# EAGLE schematic enut30d (EAGLE 4.11)

## Sheet 1 of 4
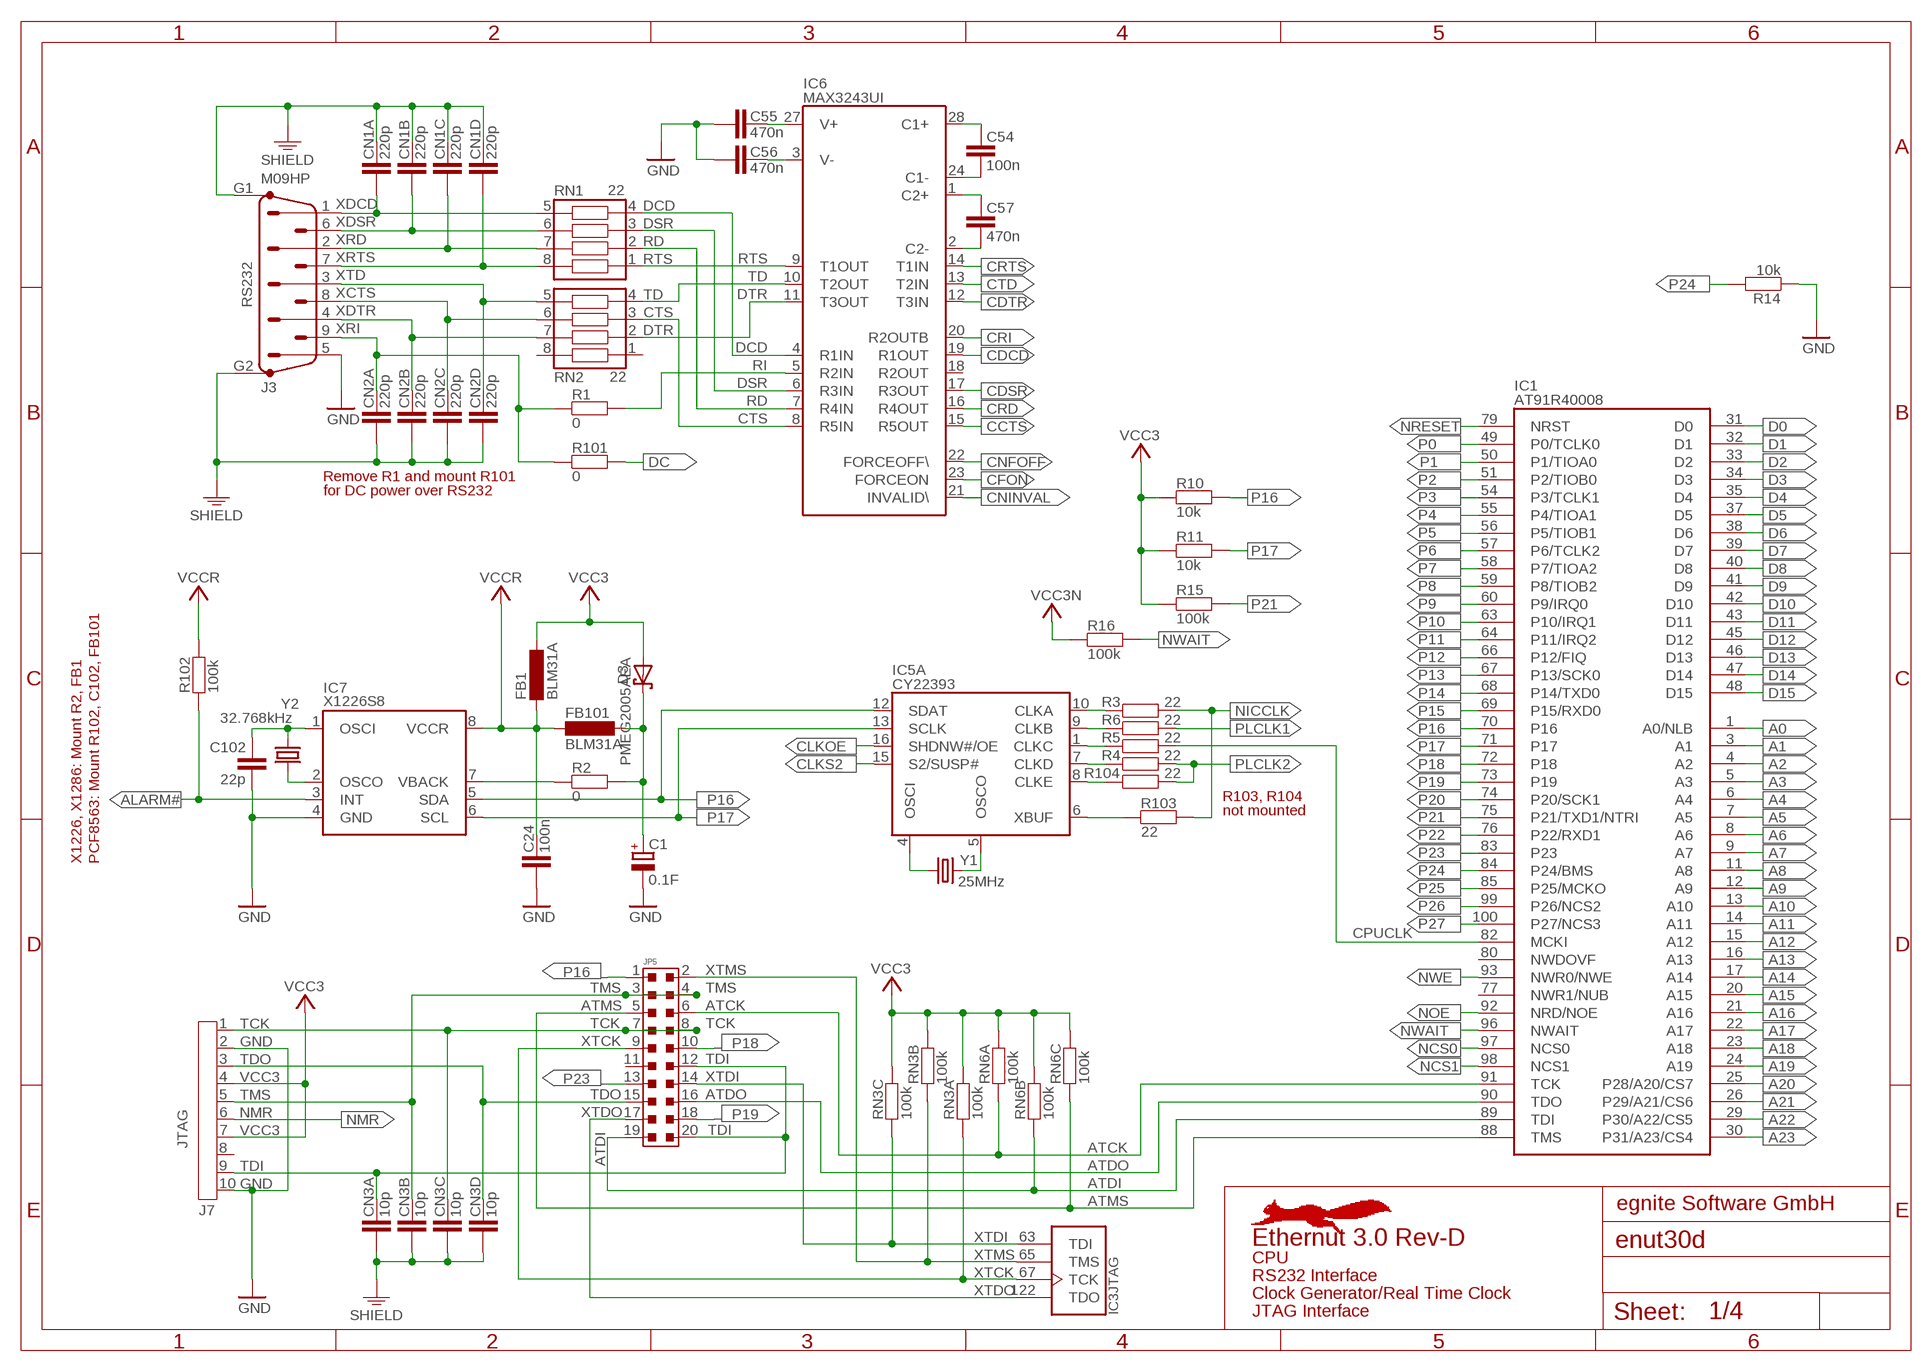
[diagram p0: schematic, sheet 1]

### Parts
C1  0.1F  FG0H104Z135  [CDL13_5]
C24  100n  C0603  [C0603]
C54  100n  C0603  [C0603]
C55  470n  C0603  [C0603]
C56  470n  C0603  [C0603]
C57  470n  C0603  [C0603]
C102  22p  C0603  [C0603]
CN1  220p  NCA1206  [NCA1206]
CN2  220p  NCA1206  [NCA1206]
CN3  10p  NCA1206  [NCA1206]
D3  PMEG2005AEA  [SOD323]
FB1  BLM31A  [BLM31]
FB101  BLM31A  [BLM31]
IC1  AT91R40008  [TQFP100]
IC3  XC95144XLTQ144  [XC95_TQ144]
IC5  CY22393  [TSSOP16]
IC6  MAX3243UI  [TSSOP28]
IC7  X1226S8  [SO8]
J3  M09HP  [M09HP]
J7  ML10A  [ML10A]
JP5  JP10X2  [JP10X2]
R1  0  R0603  [R0603]
R2  0  R0603  [R0603]
R3  22  R0603  [R0603]
R4  22  R0603  [R0603]
R5  22  R0603  [R0603]
R6  22  R0603  [R0603]
R10  10k  R0603  [R0603]
R11  10k  R0603  [R0603]
R14  10k  R0603  [R0603]
R15  100k  R0603  [R0603]
R16  100k  R0603  [R0603]
R101  0  R1206  [R1206]
R102  100k  R0603  [R0603]
R103  22  R0603  [R0603]
R104  22  R0603  [R0603]
RN1  22  CAY16N  [CAY16]
RN2  22  CAY16N  [CAY16]
RN3  100k  CAY16  [CAY16]
RN6  100k  CAY16  [CAY16]
Y1  25MHz  CRYSTALHC49SM  [HC49SM]
Y2  32.768kHz  MC-146  [MC-146]

### Nets
A0: IC1.1(A0/NLB) ; also sheet 2
A1: IC1.3(A1) ; also sheet 2
A2: IC1.4(A2) ; also sheet 2,3
A3: IC1.5(A3) ; also sheet 2
A4: IC1.6(A4) ; also sheet 2
A5: IC1.7(A5) ; also sheet 2
A6: IC1.8(A6) ; also sheet 2
A7: IC1.9(A7) ; also sheet 2
A8 [AddrbusH]: IC1.11(A8) ; also sheet 2
A9 [AddrbusH]: IC1.12(A9) ; also sheet 2
A10 [AddrbusH]: IC1.13(A10) ; also sheet 2
A11 [AddrbusH]: IC1.14(A11) ; also sheet 2
A12 [AddrbusH]: IC1.15(A12) ; also sheet 2
A13 [AddrbusH]: IC1.16(A13) ; also sheet 2
A14 [AddrbusH]: IC1.17(A14) ; also sheet 2
A15 [AddrbusH]: IC1.20(A15) ; also sheet 2
A16: IC1.21(A16) ; also sheet 2
A17: IC1.22(A17) ; also sheet 2
A18: IC1.23(A18) ; also sheet 2
A19: IC1.24(A19) ; also sheet 2
A20: IC1.25(P28/A20/CS7) ; also sheet 2
A21: IC1.26(P29/A21/CS6) ; also sheet 2
A22: IC1.29(P30/A22/CS5) ; also sheet 2
A23: IC1.30(P31/A23/CS4) ; also sheet 2
ALARM#: IC7.3(INT) R102.1 ; also sheet 2
ATCK: IC1.91(TCK) JP5.6 RN6.1
ATDI: IC1.89(TDI) JP5.19 RN6.2
ATDO: IC1.90(TDO) JP5.16
ATMS: IC1.88(TMS) JP5.5 RN6.3
CCTS: IC6.15(R5OUT) ; also sheet 2
CDCD: IC6.19(R1OUT) ; also sheet 2
CDSR: IC6.17(R3OUT) ; also sheet 2
CDTR: IC6.12(T3IN) ; also sheet 2
CFON: IC6.23(FORCEON) ; also sheet 2
CLKA: IC5.10(A:CLKA) R3.1
CLKB: IC5.9(A:CLKB) R6.1
CLKBUF: IC5.6(A:XBUF) R103.1
CLKC: IC5.1(A:CLKC) R5.1
CLKD: IC5.7(A:CLKD) R4.1
CLKE: IC5.8(A:CLKE) R104.1
CLKOE: IC5.16(A:SHDNW#/OE) ; also sheet 2
CLKS2: IC5.15(A:S2/SUSP#) ; also sheet 2
CNFOFF: IC6.22(FORCEOFF\) ; also sheet 2
CNINVAL: IC6.21(INVALID\) ; also sheet 2
CPUCLK: IC1.82(MCKI) R5.2
CRD: IC6.16(R4OUT) ; also sheet 2
CRI: IC6.20(R2OUTB) ; also sheet 2
CRTS: IC6.14(T1IN) ; also sheet 2
CTD: IC6.13(T2IN) ; also sheet 2
CTS: IC6.8(R5IN) RN2.3
D0 [Databus]: IC1.31(D0) ; also sheet 2,3
D1 [Databus]: IC1.32(D1) ; also sheet 2,3
D2 [Databus]: IC1.33(D2) ; also sheet 2,3
D3 [Databus]: IC1.34(D3) ; also sheet 2,3
D4 [Databus]: IC1.35(D4) ; also sheet 2,3
D5 [Databus]: IC1.37(D5) ; also sheet 2,3
D6 [Databus]: IC1.38(D6) ; also sheet 2,3
D7 [Databus]: IC1.39(D7) ; also sheet 2,3
D8: IC1.40(D8) ; also sheet 2,3
D9: IC1.41(D9) ; also sheet 2,3
D10: IC1.42(D10) ; also sheet 2,3
D11: IC1.43(D11) ; also sheet 2,3
D12: IC1.45(D12) ; also sheet 2,3
D13: IC1.46(D13) ; also sheet 2,3
D14: IC1.47(D14) ; also sheet 2,3
D15: IC1.48(D15) ; also sheet 2,3
DC: R101.2 ; also sheet 2,4
DCD: IC6.4(R1IN) RN1.4
DSR: IC6.6(R3IN) RN1.3
DTR: IC6.11(T3OUT) RN2.2
GND: C1.- C24.2 C55.2 C56.2 C102.1 IC7.4(GND) J3.5 J7.2 J7.10 R14.1 ; also sheet 2,3,4
N$1: C55.1 IC6.27(V+)
N$2: C56.1 IC6.3(V-)
N$3: C57.2 IC6.2(C2-)
N$8: C57.1 IC6.1(C2+)
N$9: C54.2 IC6.24(C1-)
N$10: C54.1 IC6.28(C1+)
N$45: IC5.4(A:OSCI) Y1.2
N$46: IC5.5(A:OSCO) Y1.1
NCS0: IC1.97(NCS0) ; also sheet 2
NCS1: IC1.98(NCS1) ; also sheet 3
NICCLK: R3.2 R103.2 ; also sheet 3
NMR: J7.6 ; also sheet 2,4
NOE: IC1.92(NRD/NOE) ; also sheet 2,3
NRESET: IC1.79(NRST) ; also sheet 2,3,4
NWAIT: IC1.96(NWAIT) R16.2 ; also sheet 2,3
NWE: IC1.93(NWR0/NWE) ; also sheet 2,3
P0: IC1.49(P0/TCLK0) ; also sheet 2
P1: IC1.50(P1/TIOA0) ; also sheet 2
P2: IC1.51(P2/TIOB0) ; also sheet 2
P3: IC1.54(P3/TCLK1) ; also sheet 2
P4: IC1.55(P4/TIOA1) ; also sheet 2
P5: IC1.56(P5/TIOB1) ; also sheet 2
P6: IC1.57(P6/TCLK2) ; also sheet 2
P7: IC1.58(P7/TIOA2) ; also sheet 2
P8: IC1.59(P8/TIOB2) ; also sheet 2
P9: IC1.60(P9/IRQ0) ; also sheet 2
P10: IC1.63(P10/IRQ1) ; also sheet 3
P11: IC1.64(P11/IRQ2) ; also sheet 2
P12: IC1.66(P12/FIQ) ; also sheet 2
P13: IC1.67(P13/SCK0) ; also sheet 2
P14: IC1.68(P14/TXD0) ; also sheet 2
P15: IC1.69(P15/RXD0) ; also sheet 2
P16: IC1.70(P16) IC5.12(A:SDAT) IC7.5(SDA) JP5.1 R10.2 ; also sheet 2
P17: IC1.71(P17) IC5.13(A:SCLK) IC7.6(SCL) R11.2 ; also sheet 2
P18: IC1.72(P18) JP5.10 ; also sheet 2
P19: IC1.73(P19) JP5.18 ; also sheet 2
P20: IC1.74(P20/SCK1) ; also sheet 2
P21: IC1.75(P21/TXD1/NTRI) R15.2 ; also sheet 2
P22: IC1.76(P22/RXD1) ; also sheet 2
P23: IC1.83(P23) JP5.13 ; also sheet 2
P24: IC1.84(P24/BMS) R14.2 ; also sheet 2,3
P25: IC1.85(P25/MCKO) ; also sheet 2
P26: IC1.99(P26/NCS2) ; also sheet 2
P27: IC1.100(P27/NCS3) ; also sheet 2
PLCLK1: R6.2 ; also sheet 2
PLCLK2: R4.2 R104.2 ; also sheet 2
RD: IC6.7(R4IN) RN1.2
RI: IC6.5(R2IN) R1.2
RTCX1: C102.2 IC7.1(OSCI) Y2.1
RTCX2: IC7.2(OSCO) Y2.4
RTS: IC6.9(T1OUT) RN1.1
SHIELD: CN1.1 CN1.2 CN1.3 CN1.4 CN2.5 CN2.6 CN2.7 CN2.8 CN3.5 CN3.6 CN3.7 CN3.8 J3.G1 J3.G2 ; also sheet 2,3
TCK: CN3.3 J7.1 JP5.7 JP5.8
TD: IC6.10(T2OUT) RN2.4
TDI: CN3.1 J7.9 JP5.12 JP5.20
TDO: CN3.4 J7.3 JP5.15
TMS: CN3.2 J7.5 JP5.3 JP5.4
VBACK: IC7.7(VBACK) R2.1
VBAT: C1.+ D3.C FB101.1 R2.2
VCC3: D3.A FB1.1 J7.4 J7.7 R10.1 R11.1 R15.1 RN3.6 RN3.7 RN3.8 RN6.6 RN6.7 RN6.8 ; also sheet 2,4
VCC3N: R16.1 ; also sheet 3,4
VCCR: C24.1 FB1.2 FB101.2 IC7.8(VCCR) R102.2
XCTS: CN2.3 J3.8 RN2.6
XDCD: CN1.8 J3.1 RN1.5
XDSR: CN1.7 J3.6 RN1.6
XDTR: CN2.2 J3.4 RN2.7
XRD: CN1.6 J3.2 RN1.7
XRI: CN2.1 J3.9 R1.1 R101.1
XRTS: CN1.5 J3.7 RN1.8
XTCK: IC3.67(TCK) JP5.9 RN3.1
XTD: CN2.4 J3.3 RN2.5
XTDI: IC3.63(TDI) JP5.14 RN3.3
XTDO: IC3.122(TDO) JP5.17
XTMS: IC3.65(TMS) JP5.2 RN3.2
Unconnected: J7.8 JP5.11 RN2.1 RN2.8 RN3.4 RN3.5 RN6.4 RN6.5

### Notes on the sheet
- RS232
- Remove R1 and mount R101
- for DC power over RS232
- R103, R104
- not mounted
- X1226, X1286: Mount R2, FB1 | PCF8563: Mount R102, C102, FB101
- JTAG
- egnite Software GmbH
- Ethernut 3.0 Rev-D
- CPU
- RS232 Interface
- Clock Generator/Real Time Clock
- JTAG Interface

## Sheet 2 of 4
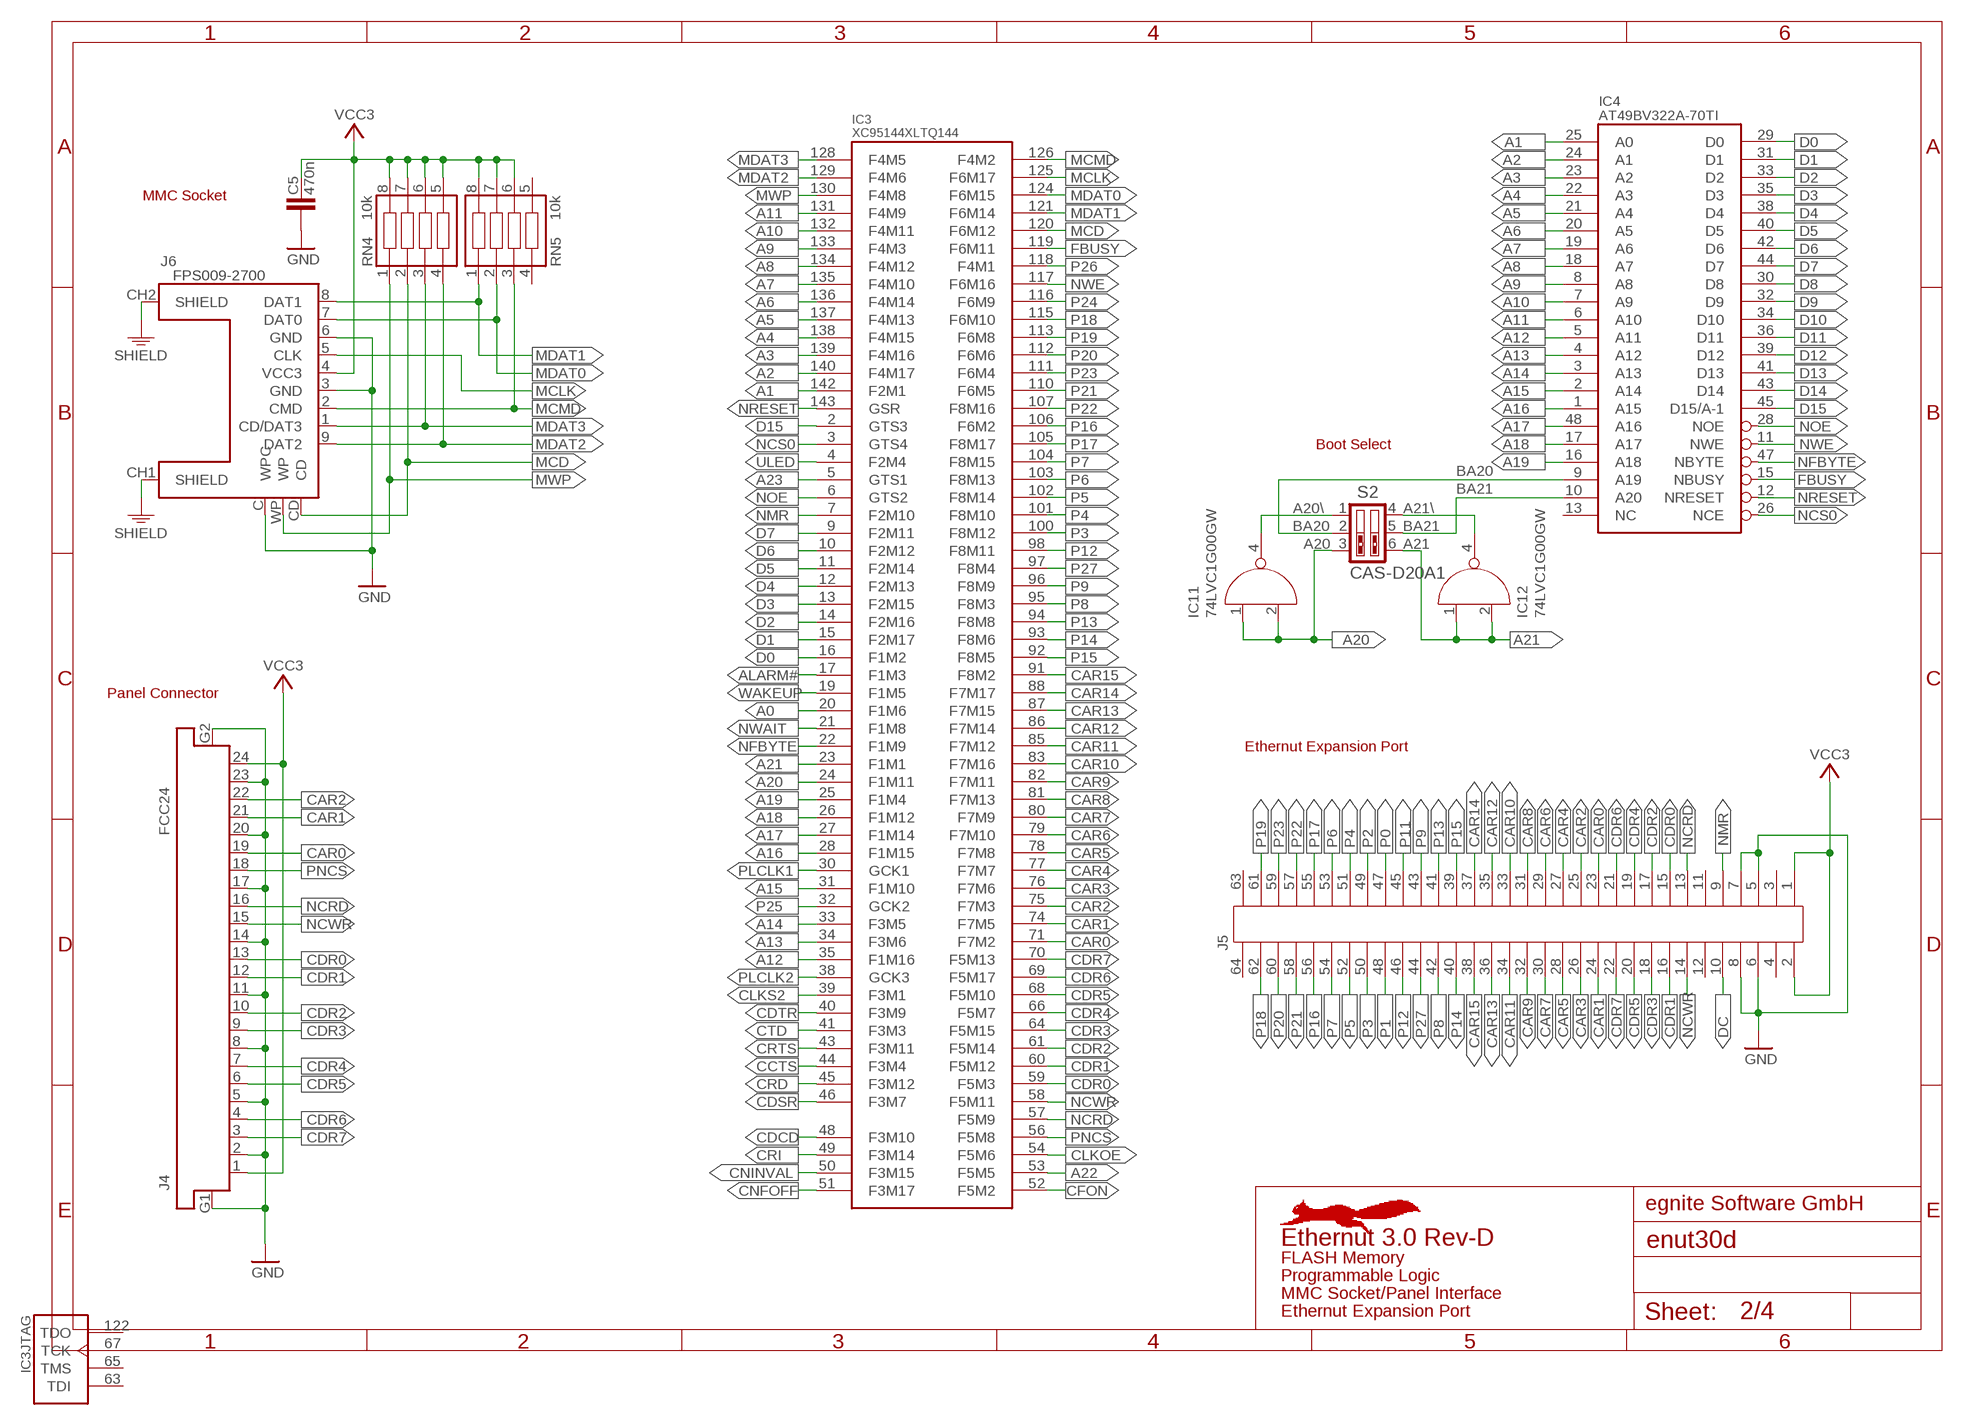
[diagram p1: schematic, sheet 2]

### Parts
C5  470n  C0603  [C0603]
IC4  AT49BV322A-70TI  [TSOP48]
IC11  74LVC1G00GW  [SOT353]
IC12  74LVC1G00GW  [SOT353]
J4  FCC24  [FFC-52437]
J5  NUTEXP  [NUTEXP]
J6  FPS009-2700  [FPS009-2700]
RN4  10k  CAY16N  [CAY16]
RN5  10k  CAY16N  [CAY16]
S2  CAS-D20A1  [CAS-D20A1]

### Nets
A0: IC3.20(F1M6) ; also sheet 1
A1: IC3.142(F2M1) IC4.25(A0) ; also sheet 1
A2: IC3.140(F4M17) IC4.24(A1) ; also sheet 1,3
A3: IC3.139(F4M16) IC4.23(A2) ; also sheet 1
A4: IC3.138(F4M15) IC4.22(A3) ; also sheet 1
A5: IC3.137(F4M13) IC4.21(A4) ; also sheet 1
A6: IC3.136(F4M14) IC4.20(A5) ; also sheet 1
A7: IC3.135(F4M10) IC4.19(A6) ; also sheet 1
A8 [AddrbusH]: IC3.134(F4M12) IC4.18(A7) ; also sheet 1
A9 [AddrbusH]: IC3.133(F4M3) IC4.8(A8) ; also sheet 1
A10 [AddrbusH]: IC3.132(F4M11) IC4.7(A9) ; also sheet 1
A11 [AddrbusH]: IC3.131(F4M9) IC4.6(A10) ; also sheet 1
A12 [AddrbusH]: IC3.35(F1M16) IC4.5(A11) ; also sheet 1
A13 [AddrbusH]: IC3.34(F3M6) IC4.4(A12) ; also sheet 1
A14 [AddrbusH]: IC3.33(F3M5) IC4.3(A13) ; also sheet 1
A15 [AddrbusH]: IC3.31(F1M10) IC4.2(A14) ; also sheet 1
A16: IC3.28(F1M15) IC4.1(A15) ; also sheet 1
A17: IC3.27(F1M14) IC4.48(A16) ; also sheet 1
A18: IC3.26(F1M12) IC4.17(A17) ; also sheet 1
A19: IC3.25(F1M4) IC4.16(A18) ; also sheet 1
A20: IC3.24(F1M11) IC11.1(I0) IC11.2(I1) S2.3(3A) ; also sheet 1
A20\: IC11.4(O) S2.1(1A)
A21: IC3.23(F1M1) IC12.1(I0) IC12.2(I1) S2.6(3B) ; also sheet 1
A21\: IC12.4(O) S2.4(1B)
A22: IC3.53(F5M5) ; also sheet 1
A23: IC3.5(GTS1) ; also sheet 1
ALARM#: IC3.17(F1M3) ; also sheet 1
BA20: IC4.9(A19) S2.2(2A)
BA21: IC4.10(A20) S2.5(2B)
CAR0: IC3.71(F7M2) J4.19 J5.23
CAR1: IC3.74(F7M5) J4.21 J5.24
CAR2: IC3.75(F7M3) J4.22 J5.25
CAR3: IC3.76(F7M6) J5.26
CAR4: IC3.77(F7M7) J5.27
CAR5: IC3.78(F7M8) J5.28
CAR6: IC3.79(F7M10) J5.29
CAR7: IC3.80(F7M9) J5.30
CAR8: IC3.81(F7M13) J5.31
CAR9: IC3.82(F7M11) J5.32
CAR10: IC3.83(F7M16) J5.33
CAR11: IC3.85(F7M12) J5.34
CAR12: IC3.86(F7M14) J5.35
CAR13: IC3.87(F7M15) J5.36
CAR14: IC3.88(F7M17) J5.37
CAR15: IC3.91(F8M2) J5.38
CCTS: IC3.44(F3M4) ; also sheet 1
CDCD: IC3.48(F3M10) ; also sheet 1
CDR0: IC3.59(F5M3) J4.13 J5.15
CDR1: IC3.60(F5M12) J4.12 J5.16
CDR2: IC3.61(F5M14) J4.10 J5.17
CDR3: IC3.64(F5M15) J4.9 J5.18
CDR4: IC3.66(F5M7) J4.7 J5.19
CDR5: IC3.68(F5M10) J4.6 J5.20
CDR6: IC3.69(F5M17) J4.4 J5.21
CDR7: IC3.70(F5M13) J4.3 J5.22
CDSR: IC3.46(F3M7) ; also sheet 1
CDTR: IC3.40(F3M9) ; also sheet 1
CFON: IC3.52(F5M2) ; also sheet 1
CLKOE: IC3.54(F5M6) ; also sheet 1
CLKS2: IC3.39(F3M1) ; also sheet 1
CNFOFF: IC3.51(F3M17) ; also sheet 1
CNINVAL: IC3.50(F3M15) ; also sheet 1
CRD: IC3.45(F3M12) ; also sheet 1
CRI: IC3.49(F3M14) ; also sheet 1
CRTS: IC3.43(F3M11) ; also sheet 1
CTD: IC3.41(F3M3) ; also sheet 1
D0 [Databus]: IC3.16(F1M2) IC4.29(D0) ; also sheet 1,3
D1 [Databus]: IC3.15(F2M17) IC4.31(D1) ; also sheet 1,3
D2 [Databus]: IC3.14(F2M16) IC4.33(D2) ; also sheet 1,3
D3 [Databus]: IC3.13(F2M15) IC4.35(D3) ; also sheet 1,3
D4 [Databus]: IC3.12(F2M13) IC4.38(D4) ; also sheet 1,3
D5 [Databus]: IC3.11(F2M14) IC4.40(D5) ; also sheet 1,3
D6 [Databus]: IC3.10(F2M12) IC4.42(D6) ; also sheet 1,3
D7 [Databus]: IC3.9(F2M11) IC4.44(D7) ; also sheet 1,3
D8: IC4.30(D8) ; also sheet 1,3
D9: IC4.32(D9) ; also sheet 1,3
D10: IC4.34(D10) ; also sheet 1,3
D11: IC4.36(D11) ; also sheet 1,3
D12: IC4.39(D12) ; also sheet 1,3
D13: IC4.41(D13) ; also sheet 1,3
D14: IC4.43(D14) ; also sheet 1,3
D15: IC3.2(GTS3) IC4.45(D15/A-1) ; also sheet 1,3
DC: J5.10 ; also sheet 1,4
FBUSY: IC3.119(F6M11) IC4.15(NBUSY)
GND: C5.2 J4.2 J4.5 J4.8 J4.11 J4.14 J4.17 J4.20 J4.23 J4.G1 J4.G2 J5.5 J5.6 J5.7 J5.8 J6.3(GND) J6.6(GND) J6.C(WPC) ; also sheet 1,3,4
MCD: IC3.120(F6M12) J6.CD RN4.2
MCLK: IC3.125(F6M17) J6.5(CLK)
MCMD: IC3.126(F4M2) J6.2(CMD) RN5.3
MDAT0: IC3.124(F6M15) J6.7(DAT0) RN5.2
MDAT1: IC3.121(F6M14) J6.8(DAT1) RN5.1
MDAT2: IC3.129(F4M6) J6.9(DAT2) RN4.4
MDAT3: IC3.128(F4M5) J6.1(CD/DAT3) RN4.3
MWP: IC3.130(F4M8) J6.WP RN4.1
NCRD: IC3.57(F5M9) J4.16 J5.13
NCS0: IC3.3(GTS4) IC4.26(NCE) ; also sheet 1
NCWR: IC3.58(F5M11) J4.15 J5.14
NFBYTE: IC3.22(F1M9) IC4.47(NBYTE)
NMR: IC3.7(F2M10) J5.9 ; also sheet 1,4
NOE: IC3.6(GTS2) IC4.28(NOE) ; also sheet 1,3
NRESET: IC3.143(GSR) IC4.12(NRESET) ; also sheet 1,3,4
NWAIT: IC3.21(F1M8) ; also sheet 1,3
NWE: IC3.117(F6M16) IC4.11(NWE) ; also sheet 1,3
P0: J5.47 ; also sheet 1
P1: J5.48 ; also sheet 1
P2: J5.49 ; also sheet 1
P3: IC3.100(F8M12) J5.50 ; also sheet 1
P4: IC3.101(F8M10) J5.51 ; also sheet 1
P5: IC3.102(F8M14) J5.52 ; also sheet 1
P6: IC3.103(F8M13) J5.53 ; also sheet 1
P7: IC3.104(F8M15) J5.54 ; also sheet 1
P8: IC3.95(F8M3) J5.42 ; also sheet 1
P9: IC3.96(F8M9) J5.43 ; also sheet 1
P11: J5.45 ; also sheet 1
P12: IC3.98(F8M11) J5.46 ; also sheet 1
P13: IC3.94(F8M8) J5.41 ; also sheet 1
P14: IC3.93(F8M6) J5.40 ; also sheet 1
P15: IC3.92(F8M5) J5.39 ; also sheet 1
P16: IC3.106(F6M2) J5.56 ; also sheet 1
P17: IC3.105(F8M17) J5.55 ; also sheet 1
P18: IC3.115(F6M10) J5.62 ; also sheet 1
P19: IC3.113(F6M8) J5.61 ; also sheet 1
P20: IC3.112(F6M6) J5.60 ; also sheet 1
P21: IC3.110(F6M5) J5.58 ; also sheet 1
P22: IC3.107(F8M16) J5.57 ; also sheet 1
P23: IC3.111(F6M4) J5.59 ; also sheet 1
P24: IC3.116(F6M9) ; also sheet 1,3
P25: IC3.32(GCK2) ; also sheet 1
P26: IC3.118(F4M1) ; also sheet 1
P27: IC3.97(F8M4) J5.44 ; also sheet 1
PLCLK1: IC3.30(GCK1) ; also sheet 1
PLCLK2: IC3.38(GCK3) ; also sheet 1
PNCS: IC3.56(F5M8) J4.18
SHIELD: J6.CH1(SHIELD) J6.CH2(SHIELD) ; also sheet 1,3
ULED: IC3.4(F2M4) ; also sheet 4
VCC3: C5.1 J4.1 J4.24 J5.1 J5.2 J6.4(VCC3) RN4.5 RN4.6 RN4.7 RN4.8 RN5.6 RN5.7 RN5.8 ; also sheet 1,4
WAKEUP: IC3.19(F1M5) ; also sheet 3
Unconnected: IC4.13(NC) J5.3 J5.4 J5.11 J5.12 J5.63 J5.64 RN5.4 RN5.5

### Notes on the sheet
- MMC Socket
- Boot Select
- Panel Connector
- Ethernut Expansion Port
- egnite Software GmbH
- Ethernut 3.0 Rev-D
- FLASH Memory
- Programmable Logic
- MMC Socket/Panel Interface
- Ethernut Expansion Port

## Sheet 3 of 4
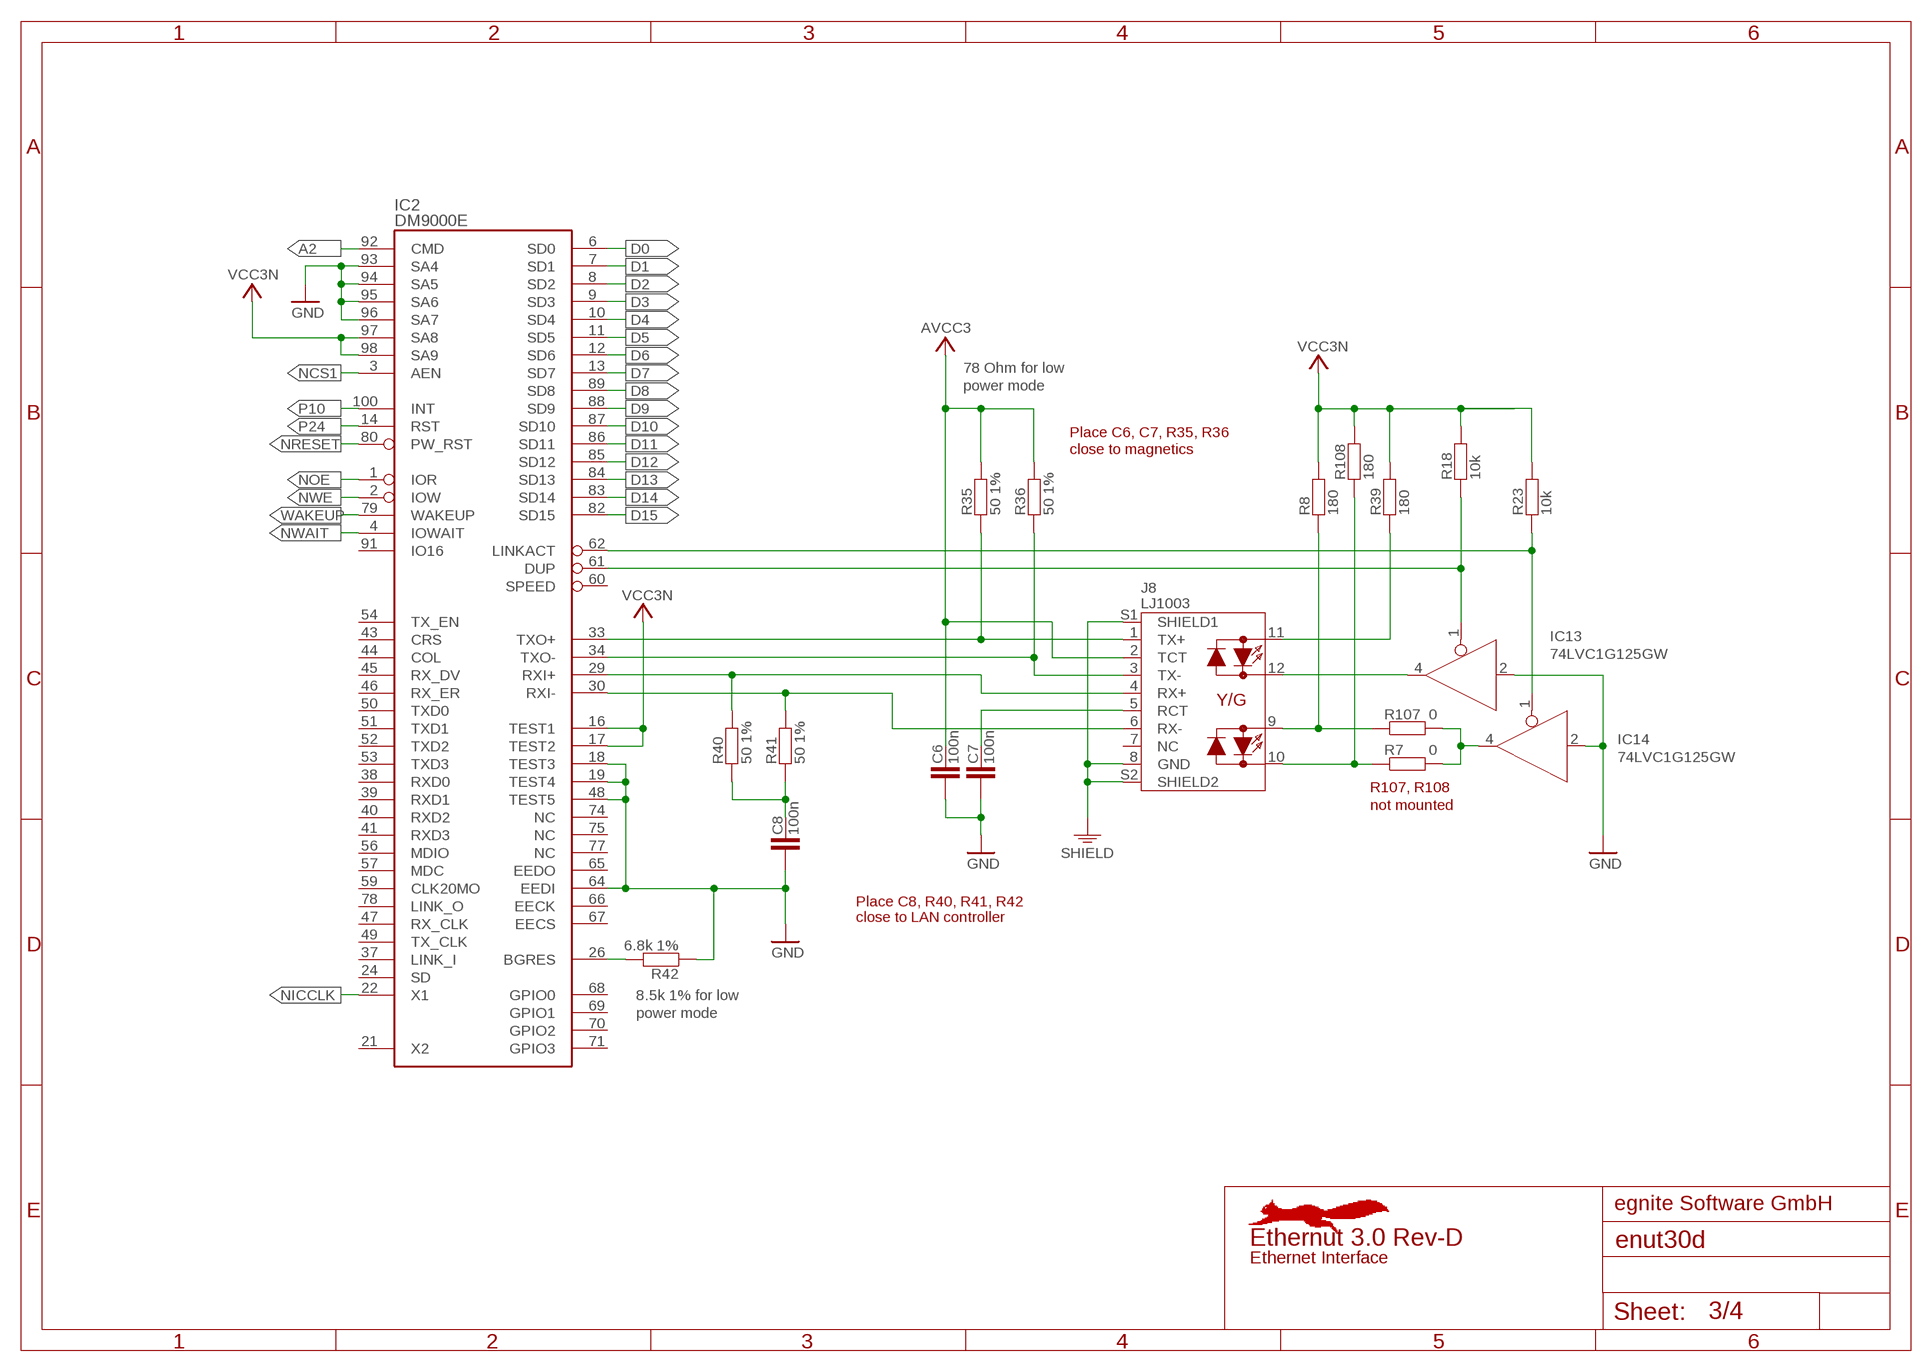
[diagram p2: schematic, sheet 3]

### Parts
C6  100n  C0603  [C0603]
C7  100n  C0603  [C0603]
C8  100n  C0603  [C0603]
IC2  DM9000E  [LQFP100]
IC13  74LVC1G125GW  [SOT353]
IC14  74LVC1G125GW  [SOT353]
J8  LJ1003  [LJ1003]
R7  0  R0603  [R0603]
R8  180  R0603  [R0603]
R18  10k  R0603  [R0603]
R23  10k  R0603  [R0603]
R35  50 1%  R0603  [R0603]
R36  50 1%  R0603  [R0603]
R39  180  R0603  [R0603]
R40  50 1%  R0603  [R0603]
R41  50 1%  R0603  [R0603]
R42  6.8k 1%  R0603  [R0603]
R107  0  R0603  [R0603]
R108  180  R0603  [R0603]

### Nets
A2: IC2.92(CMD) ; also sheet 1,2
ALEDA: J8.11(A2) R39.1
ALEDC: IC13.4(O) J8.12(C2)
AVCC3: C6.1 J8.2(TCT) R35.2 R36.2 ; also sheet 4
BIAS: IC2.26(BGRES) R42.2
D0 [Databus]: IC2.6(SD0) ; also sheet 1,2
D1 [Databus]: IC2.7(SD1) ; also sheet 1,2
D2 [Databus]: IC2.8(SD2) ; also sheet 1,2
D3 [Databus]: IC2.9(SD3) ; also sheet 1,2
D4 [Databus]: IC2.10(SD4) ; also sheet 1,2
D5 [Databus]: IC2.11(SD5) ; also sheet 1,2
D6 [Databus]: IC2.12(SD6) ; also sheet 1,2
D7 [Databus]: IC2.13(SD7) ; also sheet 1,2
D8: IC2.89(SD8) ; also sheet 1,2
D9: IC2.88(SD9) ; also sheet 1,2
D10: IC2.87(SD10) ; also sheet 1,2
D11: IC2.86(SD11) ; also sheet 1,2
D12: IC2.85(SD12) ; also sheet 1,2
D13: IC2.84(SD13) ; also sheet 1,2
D14: IC2.83(SD14) ; also sheet 1,2
D15: IC2.82(SD15) ; also sheet 1,2
GND: C6.2 C7.2 C8.2 IC2.18(TEST3) IC2.19(TEST4) IC2.48(TEST5) IC2.64(EEDI) IC2.93(SA4) IC2.94(SA5) IC2.95(SA6) IC2.96(SA7) IC13.2(I) IC14.2(I) R42.1 ; also sheet 1,2,4
LLEDA: J8.9(A1) R8.1 R107.1
LLEDC: J8.10(C1) R7.1 R108.1
LLEDOUT: IC14.4(O) R7.2 R107.2
NCS1: IC2.3(AEN) ; also sheet 1
NICCLK: IC2.22(X1) ; also sheet 1
NLEDA\: IC2.62(LINKACT) IC14.1(OE) R23.1
NLEDB\: IC2.61(DUP) IC13.1(OE) R18.1
NOE: IC2.1(IOR) ; also sheet 1,2
NRESET: IC2.80(PW_RST) ; also sheet 1,2,4
NWAIT: IC2.4(IOWAIT) ; also sheet 1,2
NWE: IC2.2(IOW) ; also sheet 1,2
P10: IC2.100(INT) ; also sheet 1
P24: IC2.14(RST) ; also sheet 1,2
RCT: C7.1 J8.5(RCT)
RXIC: C8.1 R40.1 R41.1
SHIELD: J8.8(GND) J8.S1(SHIELD1) J8.S2(SHIELD2) ; also sheet 1,2
TPI+: IC2.29(RXI+) J8.4(RX+) R40.2
TPI-: IC2.30(RXI-) J8.6(RX-) R41.2
TPO+: IC2.33(TXO+) J8.1(TX+) R35.1
TPO-: IC2.34(TXO-) J8.3(TX-) R36.1
VCC3N: IC2.16(TEST1) IC2.17(TEST2) IC2.97(SA8) IC2.98(SA9) R8.2 R18.2 R23.2 R39.2 R108.2 ; also sheet 1,4
WAKEUP: IC2.79(WAKEUP) ; also sheet 2
Unconnected: J8.7(NC)

### Notes on the sheet
- 78 Ohm for low
- power mode
- Place C6, C7, R35, R36
- close to magnetics
- R107, R108
- not mounted
- Place C8, R40, R41, R42
- close to LAN controller
- 8.5k 1% for low
- power mode
- egnite Software GmbH
- Ethernut 3.0 Rev-D
- Ethernet Interface

## Sheet 4 of 4
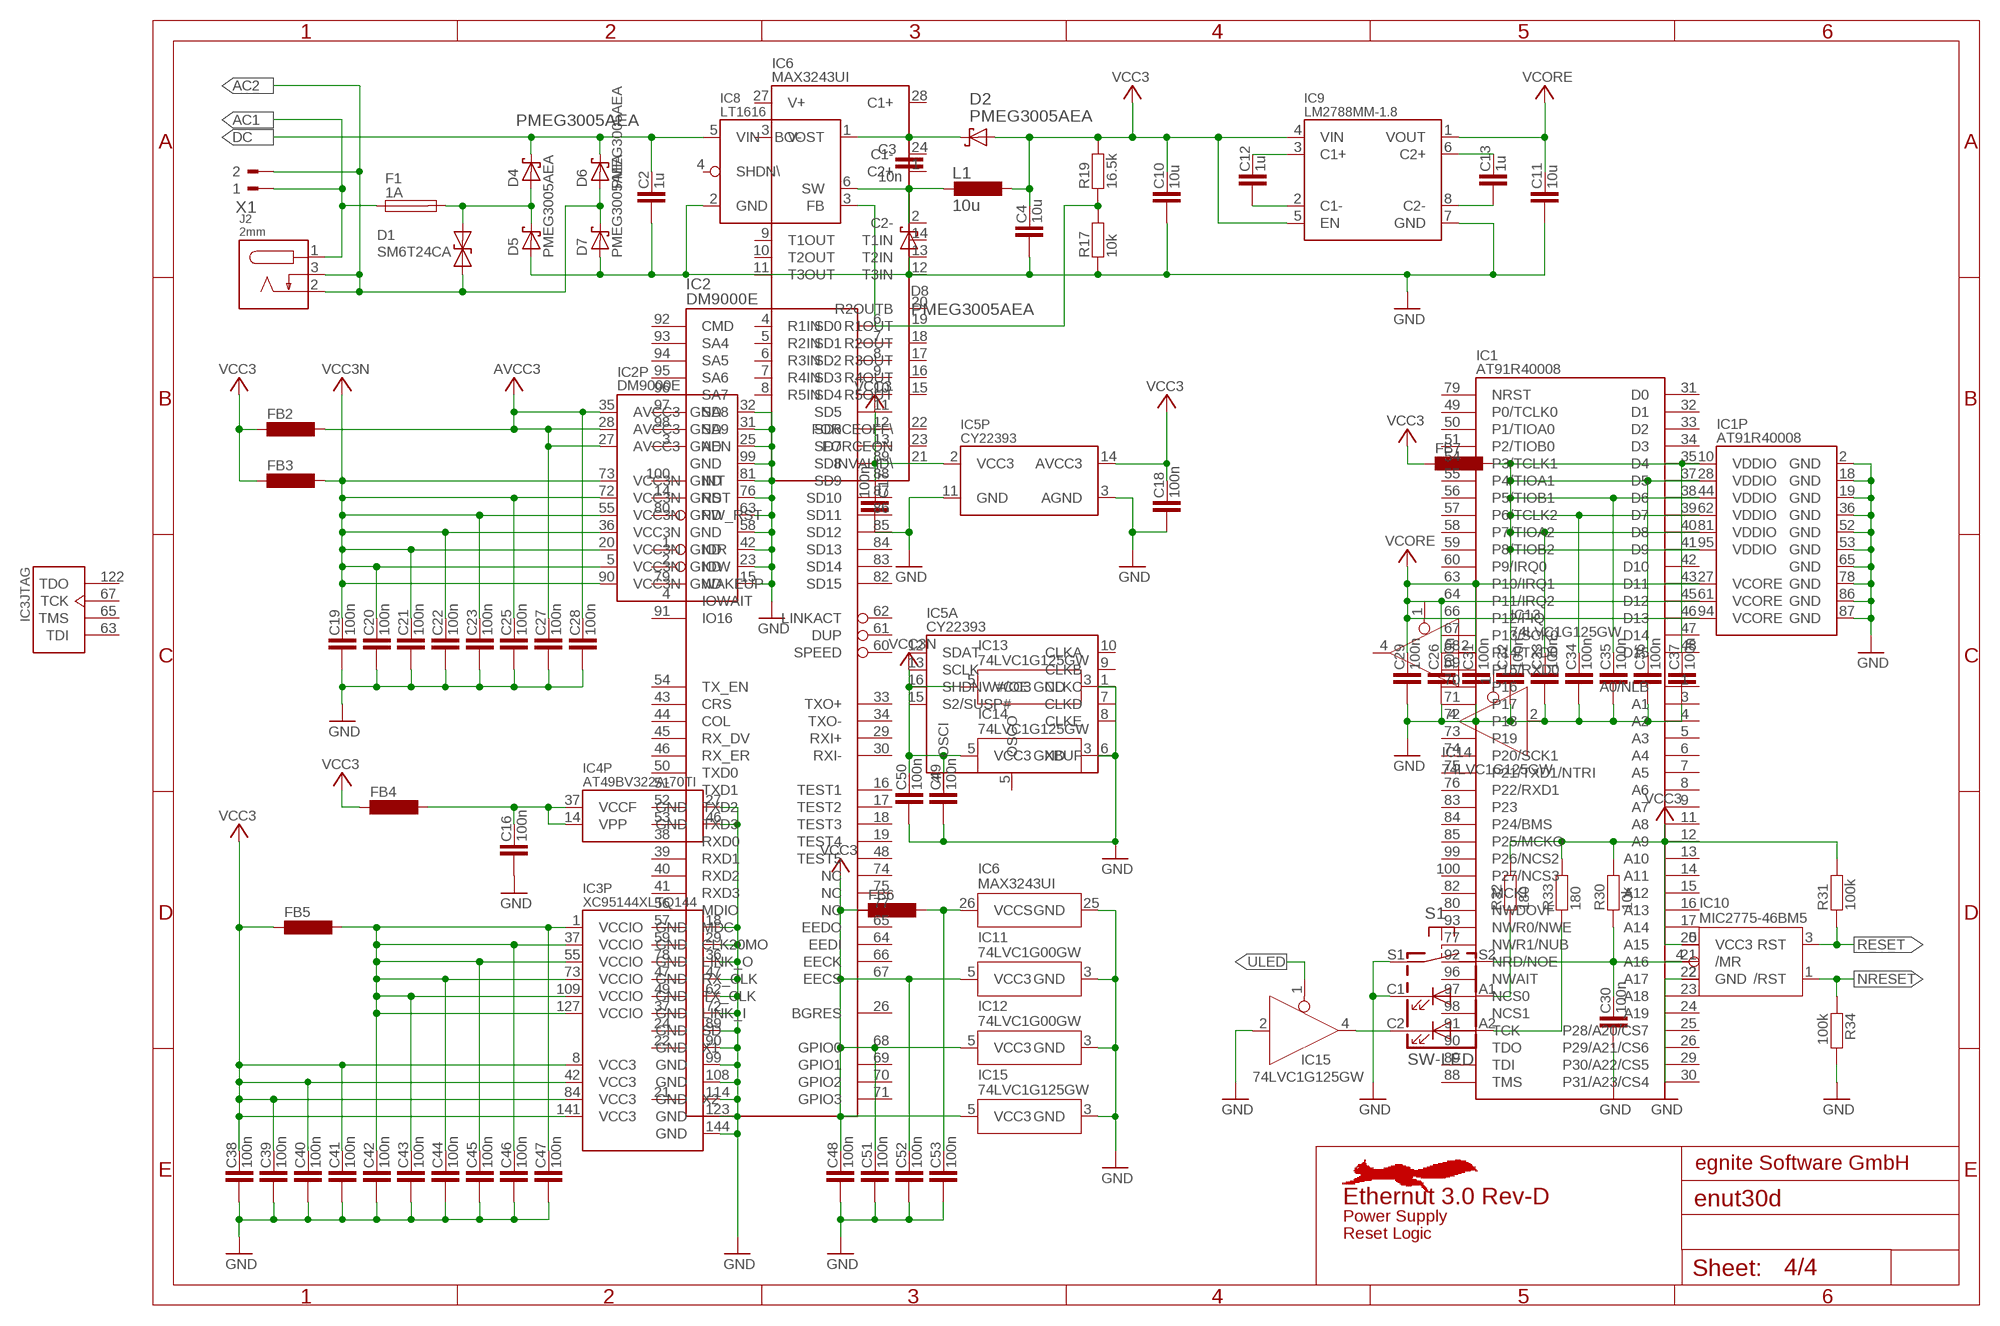
[diagram p3: schematic, sheet 4]

### Parts
C2  1u  C0805  [C0805]
C3  10n  C0603  [C0603]
C4  10u  C0805  [C0805]
C10  10u  C0805  [C0805]
C11  10u  C0805  [C0805]
C12  1u  C0805  [C0805]
C13  1u  C0805  [C0805]
C16  100n  C0603  [C0603]
C17  100n  C0603  [C0603]
C18  100n  C0603  [C0603]
C19  100n  C0603  [C0603]
C20  100n  C0603  [C0603]
C21  100n  C0603  [C0603]
C22  100n  C0603  [C0603]
C23  100n  C0603  [C0603]
C25  100n  C0603  [C0603]
C26  100n  C0603  [C0603]
C27  100n  C0603  [C0603]
C28  100n  C0603  [C0603]
C29  100n  C0603  [C0603]
C30  100n  C0603  [C0603]
C31  100n  C0603  [C0603]
C32  100n  C0603  [C0603]
C33  100n  C0603  [C0603]
C34  100n  C0603  [C0603]
C35  100n  C0603  [C0603]
C36  100n  C0603  [C0603]
C37  100n  C0603  [C0603]
C38  100n  C0603  [C0603]
C39  100n  C0603  [C0603]
C40  100n  C0603  [C0603]
C41  100n  C0603  [C0603]
C42  100n  C0603  [C0603]
C43  100n  C0603  [C0603]
C44  100n  C0603  [C0603]
C45  100n  C0603  [C0603]
C46  100n  C0603  [C0603]
C47  100n  C0603  [C0603]
C48  100n  C0603  [C0603]
C49  100n  C0603  [C0603]
C50  100n  C0603  [C0603]
C51  100n  C0603  [C0603]
C52  100n  C0603  [C0603]
C53  100n  C0603  [C0603]
D1  SM6T24CA  SM6T  [SMB]
D2  PMEG3005AEA  [SOD323]
D4  PMEG3005AEA  [SOD323]
D5  PMEG3005AEA  [SOD323]
D6  PMEG3005AEA  [SOD323]
D7  PMEG3005AEA  [SOD323]
D8  PMEG3005AEA  [SOD323]
F1  1A  OMNI-BLOK  [OMNI-BLOK]
FB2  BLM31A  [BLM31]
FB3  BLM31A  [BLM31]
FB4  BLM31A  [BLM31]
FB5  BLM31A  [BLM31]
FB6  BLM31A  [BLM31]
FB7  BLM31A  [BLM31]
IC8  LT1616  [TSOT-23-6]
IC9  LM2788MM-1.8  [MSOP-8]
IC10  MIC2775-46BM5  [SOT23-5L]
IC15  74LVC1G125GW  [SOT353]
J2  2mm  TDC-002-3  [TDC-002-3]
L1  10u  MSS5131  [MSS5131]
R17  10k  R0603  [R0603]
R19  16.5k  R0603  [R0603]
R30  10k  R0603  [R0603]
R31  100k  R0603  [R0603]
R32  180  R0603  [R0603]
R33  180  R0603  [R0603]
R34  100k  R0603  [R0603]
S1  SW-LED  [PTS-026]
X1  180-2  [180-2]

### Nets
AC1 [Supply1A]: F1.1 J2.1 X1.1
AC2 [Supply1A]: D1.A D6.A D7.C J2.2 J2.3 X1.2
ACF: D1.C D4.A D5.C F1.2
AVCC3: C27.1 C28.1 FB2.1 IC2.27(AVCC3) IC2.28(AVCC3) IC2.35(AVCC3) ; also sheet 3
DC: C2.1 D4.C D6.C IC8.5(VIN) ; also sheet 1,2
GND: C2.2 C4.2 C10.2 C11.2 C16.2 C17.2 C18.2 C19.2 C20.2 C21.2 C22.2 C23.2 C25.2 C26.2 C27.2 C28.2 C29.2 C30.2 C31.2 C32.2 C33.2 C34.2 C35.2 C36.2 C37.2 C38.2 C39.2 C40.2 C41.2 C42.2 C43.2 C44.2 C45.2 C46.2 C47.2 C48.2 C49.2 C50.2 C51.2 C52.2 C53.2 D5.A D7.A D8.A IC1.2(GND) IC1.18(GND) IC1.19(GND) IC1.36(GND) IC1.52(GND) IC1.53(GND) IC1.65(GND) IC1.78(GND) IC1.86(GND) IC1.87(GND) IC2.15(GND) IC2.23(GND) IC2.25(GND) IC2.31(GND) IC2.32(GND) IC2.42(GND) IC2.58(GND) IC2.63(GND) IC2.76(GND) IC2.81(GND) IC2.99(GND) IC3.18(GND) IC3.29(GND) IC3.36(GND) IC3.47(GND) IC3.62(GND) IC3.72(GND) IC3.89(GND) IC3.90(GND) IC3.99(GND) IC3.108(GND) IC3.114(GND) IC3.123(GND) IC3.144(GND) IC4.27(GND) IC4.46(GND) IC5.3(P:AGND) IC5.11(P:GND) IC6.25(GND) IC8.2(GND) IC9.7(GND) IC10.2(GND) IC11.3(GND) IC12.3(GND) IC13.3(GND) IC14.3(GND) IC15.2(I) IC15.3(GND) R17.1 R34.2 S1.C1 S1.S1 ; also sheet 1,2,3
N$5: IC15.4(O) S1.C2
N$13: IC8.3(FB) R17.2 R19.1
N$18: C12.1 IC9.3(C1+)
N$19: C12.2 IC9.2(C1-)
N$21: C13.1 IC9.6(C2+)
N$23: C13.2 IC9.8(C2-)
N$49: R32.1 S1.A1
N$50: R33.1 S1.A2
NMR: C30.1 IC10.4(/MR) R30.1 S1.S2 ; also sheet 1,2
NRESET: IC10.1(/RST) R34.1 ; also sheet 1,2,3
RESET: IC10.3(RST) R31.1
ULED: IC15.1(OE) ; also sheet 2
VBOOST: C3.1 D2.C IC8.1(BOOST)
VCC3: C4.1 C10.1 C17.1 C18.1 C38.1 C39.1 C40.1 C41.1 C48.1 C51.1 C52.1 D2.A FB2.2 FB3.2 FB4.2 FB5.2 FB6.2 FB7.2 IC3.8(VCC3) IC3.42(VCC3) IC3.84(VCC3) IC3.141(VCC3) IC5.2(P:VCC3) IC5.14(P:AVCC3) IC9.4(VIN) IC9.5(EN) IC10.5(VCC3) IC11.5(VCC3) IC12.5(VCC3) IC15.5(VCC3) L1.1 R19.2 R30.2 R31.2 R32.2 R33.2 ; also sheet 1,2
VCC3N: C19.1 C20.1 C21.1 C22.1 C23.1 C25.1 C49.1 C50.1 FB3.1 IC2.5(VCC3N) IC2.20(VCC3N) IC2.36(VCC3N) IC2.55(VCC3N) IC2.72(VCC3N) IC2.73(VCC3N) IC2.90(VCC3N) IC13.5(VCC3) IC14.5(VCC3) ; also sheet 1,3
VCCF: C16.1 FB4.1 IC4.14(VPP) IC4.37(VCCF)
VCCIO: C42.1 C43.1 C44.1 C45.1 C46.1 C47.1 FB5.1 IC3.1(VCCIO) IC3.37(VCCIO) IC3.55(VCCIO) IC3.73(VCCIO) IC3.109(VCCIO) IC3.127(VCCIO)
VCCS: C53.1 FB6.1 IC6.26(VCCS)
VCORE: C11.1 C26.1 C29.1 C31.1 IC1.27(VCORE) IC1.61(VCORE) IC1.94(VCORE) IC9.1(VOUT)
VDDIO: C32.1 C33.1 C34.1 C35.1 C36.1 C37.1 FB7.1 IC1.10(VDDIO) IC1.28(VDDIO) IC1.44(VDDIO) IC1.62(VDDIO) IC1.81(VDDIO) IC1.95(VDDIO)
VSWITCH: C3.2 D8.C IC8.6(SW) L1.2
Unconnected: IC1.77(NWR1/NUB) IC1.80(NWDOVF) IC2.21(X2) IC2.24(SD) IC2.37(LINK_I) IC2.38(RXD0) IC2.39(RXD1) IC2.40(RXD2) IC2.41(RXD3) IC2.43(CRS) IC2.44(COL) IC2.45(RX_DV) IC2.46(RX_ER) IC2.47(RX_CLK) IC2.49(TX_CLK) IC2.50(TXD0) IC2.51(TXD1) IC2.52(TXD2) IC2.53(TXD3) IC2.54(TX_EN) IC2.56(MDIO) IC2.57(MDC) IC2.59(CLK20MO) IC2.60(SPEED) IC2.65(EEDO) IC2.66(EECK) IC2.67(EECS) IC2.68(GPIO0) IC2.69(GPIO1) IC2.70(GPIO2) IC2.71(GPIO3) IC2.74(NC) IC2.75(NC) IC2.77(NC) IC2.78(LINK_O) IC2.91(IO16) IC6.18(R2OUT) IC8.4(SHDN\)

### Notes on the sheet
- egnite Software GmbH
- Ethernut 3.0 Rev-D
- Power Supply
- Reset Logic

## Library data of the parts
C1 = enut3:FG0H104Z: Double Layer Cap NEC/Tokin FG Series 11mm body
C2-C8 C10-C13 C16-C57 C102 = enut3:C: Ceramic Chip Capacitor
CN1-CN3 = enut3:NCA1206: Ceramic Chip Capacitor Array NIC Components
D1 = enut202:SM6T: Bidirectional Transient Voltage Suppressor
D2-D8 = enut3:PMEG*05AEA: Schottky Barrier Rectifier Very low forward voltage
F1 = enut202:OMNI-BLOK: Littlefuse OMNI-BLOK Fuseholder with Fuse
FB1-FB7 FB101 = enut3:BLM31A: Murata Ferrite Bead EMI Suppression Filter BLM31AJ601SN1L Lead Free 600 Ω @100 MHz 200 mA DC Resistance 0.9 Ω
IC1 = enut3:AT91R40008: Atmel ARM7 CPU
IC2 = enut3:DM9000E: Davicom Ethernet Controller ISA to Ethernet MAC controller with integrated 10/100 PHY
IC3 = enut3:XC95144XLTQ144: Xilinx CPLD
IC4 = enut3:AT49BV322A*: Atmel 32 Mbit 3V Flash Memory 2 MByte x 16 or 4 MByte x 8
IC5 = enut3:CY22393: Cypress Programmable Clock Generator
IC6 = enut3:MAX3243*: RS-232 Transceivers with AutoShutdown 1µA Supply-Current, True +3V to +5.5V http://dbserv.maxim-ic.com/
IC7 = enut3:X1226: Real Time Clock/Calendar with EEPROM
IC8 = enut3:LT1616: Linear Technology Step Down Switching Regulator
IC9 = enut3:LM2788: National Semi Step-Down Switched Capacitor Voltage Converter 120mA High Efficiency Step-Down Switched Capacitor Voltage Converter
IC10 = enut3:MIC2775-*: Micrel Voltage Supervisor
IC11 IC12 = enut3:74*1G00: Philips Picogate
IC13-IC15 = enut3:74*1G125: Philips Picogate Bus buffer/line drivers; 3-state
J2 = enut3:TDC-002-3: DC Power Socket
J3 = enut3:M09HP: SUB-D
J4 = enut3:FCC24: Flat Cable Connector
J5 = enut3:NUTEXP: Pin Header 2 x 32 with 2.54 mm grid
J6 = enut3:FPS009-2700: Yamaichi SD Card & MMC Socket
J7 = enut3:ML10: Pinheader 2 x 5 with 2.54 mm grid, boxed (JTAG)
J8 = enut3:LJ1003: RJ45 LEDs/Magnetics
JP5 = enut3:JP10X2: Pinheader 2 x 10 with 2mm grid
L1 = enut3:MSS5131: Coilcraft Power Inductor
R1-R8 R10 R11 R14-R19 R23 R30-R36 R39-R42 R101-R104 R107 R108 = enut3:R: Chip Resistor
RN1 RN2 RN4 RN5 = enut3:CAY16N: Resistor Array Single schematic symbol
RN3 RN6 = enut3:CAY16: Chip Resistor Array Multiple schematic symbols
S1 = enut3:SW-LED: Citizen Lumiswitch with 2 LEDs LS9 (20 mA LEDs)
S2 = enut3:CAS-D20A1: SMD Slide Switch
X1 = enut3:180-2: WEIDMUELLER CLAMP CONNECTOR
Y1 = enut3:CRYSTAL: Crystal
Y2 = enut3:MC-146: Clock Crystal SMD

## Net classes
1 Supply1A: width 0.61 mm
4 Ground: width 0.406 mm